# EAGLE design Xbee Battery (EAGLE 6.6.0)
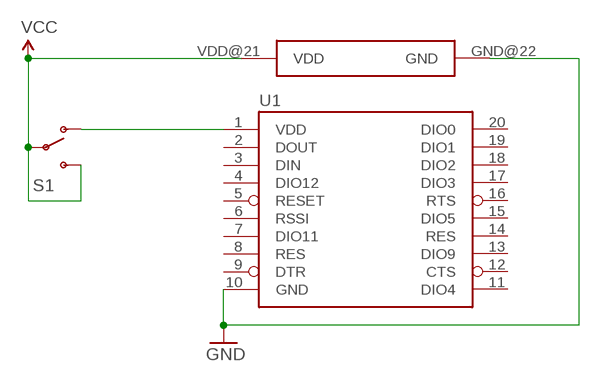
[diagram p0: schematic, sheet 1]

## Parts
S1  SWITCH_SPDT_SMD-A  [SWITCH-SPST-SMD-A]
U1  XBEE-1  [XBEE-1]

## Nets
GND: U1.10(GND) U1.GND@22(GND)
N$1: S1.1(O) U1.1(VDD)
VCC: S1.2(P) S1.3(S) U1.VDD@21(VDD)
Unconnected: U1.2(DOUT) U1.3(DIN) U1.4(DIO12) U1.5(RESET) U1.6(RSSI) U1.7(DIO11) U1.8(RES) U1.9(DTR) U1.11(DIO4) U1.12(CTS) U1.13(DIO9) U1.14(RES) U1.15(DIO5) U1.16(RTS) U1.17(DIO3) U1.18(DIO2) U1.19(DIO1) U1.20(DIO0)

## Library data of the parts
S1 = tengfeic:SWITCH_SPDT_SMD-A
U1 = tengfeic:XBEE-1: Xbee module footprints SMT header is CONN-09042.

## Board
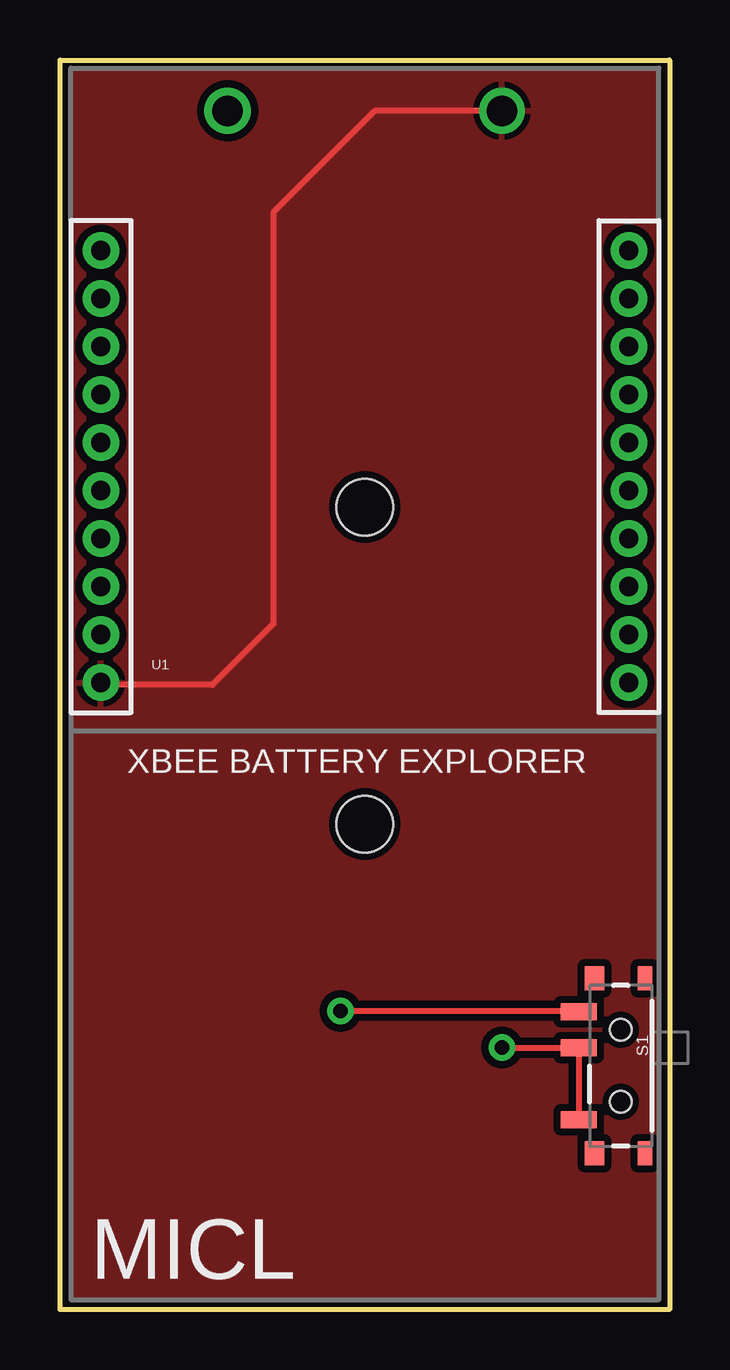
[diagram p1: board, top side]
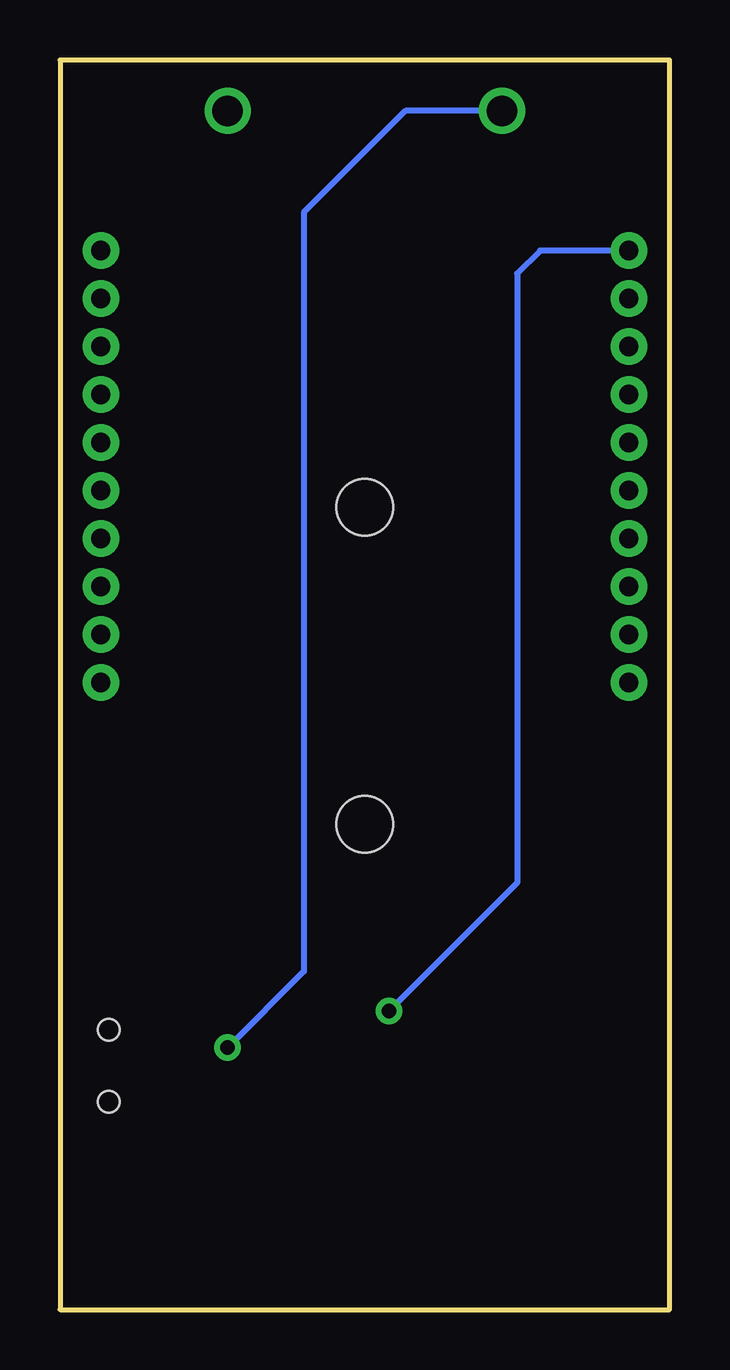
[diagram p2: board, bottom side, seen from below]

Size 25.4 x 52.07 mm. Coordinates in mm from the lower left corner, seen from the top.
Outline: 0,52.07 25.4,52.07 25.4,0 0,0 0,52.07
Copper layers (1*16): Top 0.035mm / dielectric 1.5mm / Bottom 0.035mm
Design rules "SparkFun": minimum track width 8mil, minimum drill 20mil, track to track 8mil, track to pad 8mil, pad to pad 8mil, via to via 8mil, smd to smd 8mil, copper to edge 8mil, drill to drill 8mil, minimum pad ring 12mil, minimum via ring 10mil, stop-mask expansion 4mil, vias tented up to drill 20mil, thermal gap 10mil

### Footprints (pad centres in the part's own frame; a part is rotated, then mirrored left to right if it is on the bottom)
SWITCH-SPST-SMD-A = smd 0.7 x 1.5: 1 -2.25,-1.75; 2 -0.75,-1.75; 3 2.25,-1.75 | smd 1 x 0.6: GND1 -3.65,1; GND3 3.65,1 | smd 1 x 0.8: GND2 -3.65,-1.1; GND4 3.65,-1.1 | hole 0.9: -1.5,0; 1.5,0
XBEE-1 = drill 0.8 pad 1.524: 1 -11,20; 2 -11,18; 3 -11,16; 4 -11,14; 5 -11,12; 6 -11,10; 7 -11,8; 8 -11,6; 9 -11,4; 10 -11,2; 11 11,2; 12 11,4; 13 11,6; 14 11,8; 15 11,10; 16 11,12; 17 11,14; 18 11,16; 19 11,18; 20 11,20 | drill 1.27: GND@22 5.715,25.822 | drill 1.27 pad 1.93: VDD@21 -5.715,25.822 | hole 2.362: 0,9.312; 0,-3.896

### Placement (x,y rotation side)
S1  23.37,10.16 270 top
U1  12.7,24.13 0 top

### Tracks (layer width: path | path; a pad name or v marks a point on that pad's centre or on a via)
GND
  Top 0.254: U1.GND@22 13.12,49.95 8.89,45.72 8.89,28.57 6.35,26.04 1.79,26.04 U1.10
  pour Top (isolate 0.305): 0,0 0,52.07 25.4,52.07 25.4,0
N$1  (via drill 0.6)
  Top 0.254: v11.68,12.45 21.58,12.45 S1.1
  Bottom 0.254: U1.1 5.4,44.13 6.35,43.18 6.35,17.78 v11.68,12.45
VCC  (via drill 0.6)
  Top 0.254: v18.41,10.92 21.61,10.92 S1.2 S1.3
  Bottom 0.254: U1.VDD@21 11.01,49.95 15.24,45.72 15.24,14.1 v18.41,10.92

### Text on the board
tPlace: XBEE BATTERY EXPLORER | MICL